# EAGLE schematic plant (EAGLE 9.6.1)
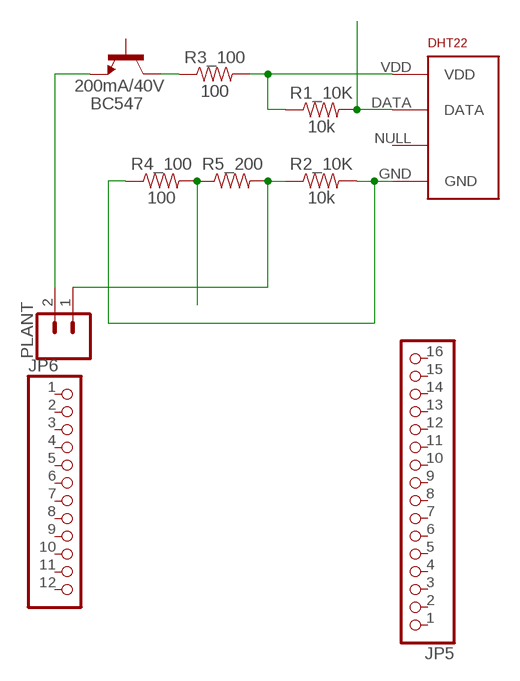
[diagram p0: schematic, sheet 1]

## Parts
BC547  200mA/40V  TRANS_NPN-2N3904  [TO-92]
DHT22  RHT03_DHT-22_AM2302  [RHT03_DHT-22]
JP5  HEADER-1X16ROUND  [1X16_ROUND]
JP6  HEADER-1X12  [1X12_ROUND]
PLANT  CONN_02  [1X02]
R1_10K  10k  10KOHM-HORIZ-1/4W-1%  [AXIAL-0.3]
R2_10K  10k  10KOHM-HORIZ-1/4W-1%  [AXIAL-0.3]
R3_100  100  100OHM-HORIZ-1/4W-1%  [AXIAL-0.3]
R4_100  100  100OHM-HORIZ-1/4W-1%  [AXIAL-0.3]
R5_200  RESISTORAXIAL-0.3  [AXIAL-0.3]

## Nets
N$2: DHT22.DATA R1_10K.P$2
N$3: BC547.3(C) R3_100.P$1
N$4: BC547.1(E) PLANT.2
N$6: DHT22.GND R2_10K.P$2 R4_100.P$1
N$7: PLANT.1 R2_10K.P$1 R5_200.P$2
N$8: DHT22.VDD R1_10K.P$1 R3_100.P$2
N$9: R4_100.P$2 R5_200.P$1
Unconnected: BC547.2(B) DHT22.NULL JP5.1 JP5.2 JP5.3 JP5.4 JP5.5 JP5.6 JP5.7 JP5.8 JP5.9 JP5.10 JP5.11 JP5.12 JP5.13 JP5.14 JP5.15 JP5.16 JP6.1 JP6.2 JP6.3 JP6.4 JP6.5 JP6.6 JP6.7 JP6.8 JP6.9 JP6.10 JP6.11 JP6.12

## Library data of the parts
BC547 = SparkFun-DiscreteSemi:TRANS_NPN: NPN transistor Current controlled devices typically used to amplify current or used as a switch. BC547 - COM-08928 <http://www.sparkfun.com/products/8928> (TO-92 45V 100mA) (1.Collector 2.Base 3.Emitter) 2N3904 - COM-00521 <http://www.sparkfun.com/products/521> (TO-92 40V 200mA) (1.Emitter 2.Base 3.Collector) P2N2222A - COM-12852 <http://www.sparkfun.com/products/12852> (TO-92 40V 600mA) (1.Collector 2.Base 3.Emitter); PROD_ID: TRANS-08447
DHT22 = RHT03_DHT-22_AM2302:RHT03_DHT-22_AM2302: RHT03 / DHT-22 / AM2302 Packages and symbol for the RHT03 / DHT-22 relative humidity and temperature sensor. Note: The AM2302 is a wired version of the DHT-22 which typically requires less clearance and is thus provided as a separate package.; PROD_ID: SEN-10167
JP5 = microbuilder:HEADER-1X16: PIN HEADER
JP6 = microbuilder:HEADER-1X12
PLANT = SparkFun-Connectors:CONN_02: Multi connection point. Often used as Generic Header-pin footprint for 0.1 inch spaced/style header connections On any of the 0.1 inch spaced packages, you can populate with these: Break Away Headers - Straight <https://www.sparkfun.com/products/116> (PRT-00116) Break Away Male Headers - Right Angle <https://www.sparkfun.com/products/553> (PRT-00553) Female Headers <https://www.sparkfun.com/products/115> (PRT-00115) Break Away Headers - Machine Pin <https://www.sparkfun.com/products/117> (PRT-00117) Break Away Female Headers - Swiss Machine Pin <https://www.sparkfun.com/products/743> (PRT-00743) For SCREWTERMINALS and SPRING TERMINALS visit here: Screw Terimnals on SparkFun.com <https://www.sparkfun.com/search/results?term=Screw+Terminals> (5mm/3.5mm/2.54mm spacing) This device is also useful as a general connection point to wire up your design to another part of your project. Our various solder wires solder well into these plated through hole pads. Hook-Up Wire - Assortment (Stranded, 22 AWG) <https://www.sparkfun.com/products/11375> (PRT-11375) Hook-Up Wire - Assortment (Solid Core, 22 AWG) <https://www.sparkfun.com/products/11367> (PRT-11367) View the entire wire category on our website here <https://www.sparkfun.com/categories/141> Special notes: Molex polarized connector foot print use with: PRT-08233 with associated crimp pins and housings. 2.54_SCREWTERM for use with PRT-10571. 3.5mm Screw Terminal footprints for PRT-08084 5mm Screw Terminal footprints for use with PRT-08432
R1_10K R2_10K = SparkFun-Resistors:10KOHM: 10kΩ resistor A resistor is a passive two-terminal electrical component that implements electrical resistance as a circuit element. Resistors act to reduce current flow, and, at the same time, act to lower voltage levels within circuits. - Wikipedia; PROD_ID: RES-12183
R3_100 R4_100 = SparkFun-Resistors:100OHM: 100Ω resistor A resistor is a passive two-terminal electrical component that implements electrical resistance as a circuit element. Resistors act to reduce current flow, and, at the same time, act to lower voltage levels within circuits. - Wikipedia; PROD_ID: RES-12181
R5_200 = SparkFun-Resistors:RESISTOR: Generic Resistor Package